# EAGLE schematic The Flying Jalapeno PM v01 (EAGLE 7.3.0)
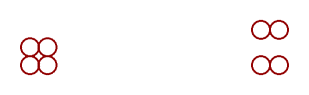
[diagram p0: schematic, sheet 1]

## Parts
STANDOFF1  STAND-OFFTIGHT  [STAND-OFF-TIGHT]
STANDOFF2  STAND-OFFTIGHT  [STAND-OFF-TIGHT]
STANDOFF3  STAND-OFFTIGHT  [STAND-OFF-TIGHT]
STANDOFF4  STAND-OFFTIGHT  [STAND-OFF-TIGHT]
STANDOFF5  STAND-OFFTIGHT  [STAND-OFF-TIGHT]
STANDOFF6  STAND-OFFTIGHT  [STAND-OFF-TIGHT]
STANDOFF9  STAND-OFFTIGHT  [STAND-OFF-TIGHT]
STANDOFF10  STAND-OFFTIGHT  [STAND-OFF-TIGHT]

## Library data of the parts
STANDOFF1-STANDOFF6 STANDOFF9 STANDOFF10 = SparkFun-Electromechanical:STAND-OFF: #4 Stand Off This is the mechanical footprint for a #4 phillips button head screw. Use the keepout ring to avoid running the screw head into surrounding components. SKU : PRT-00447

## Net classes
0 default: width 0.203 mm
1 BIG: width 0.203 mm
2 POWER: width 0.203 mm